# Altium schematic sheet 28Pins_Schematics.SchDoc
size A2
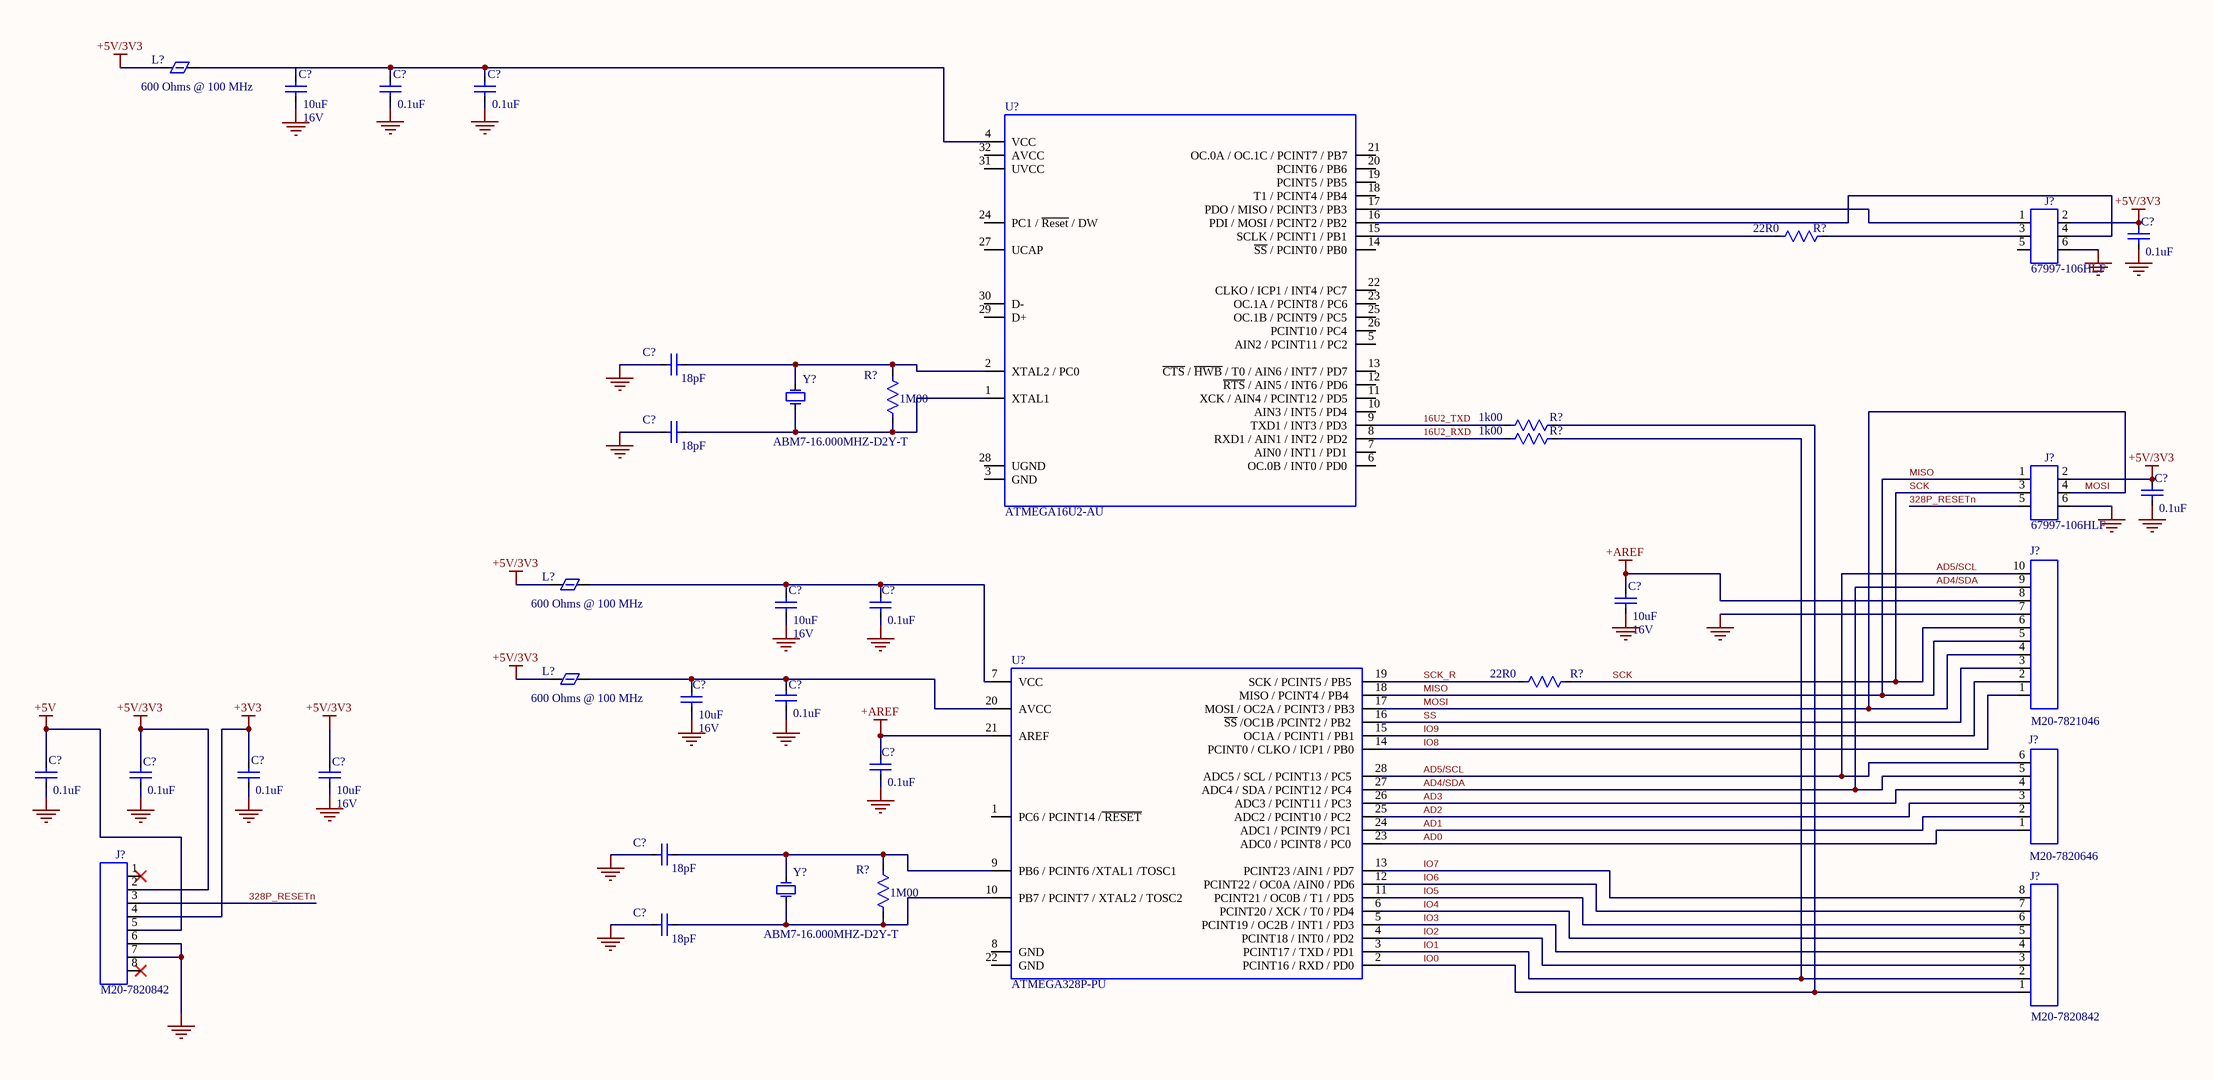
[diagram p0: 28Pins_Schematics.SchDoc]

## Parts
(Parts that share a designator on the sheet are numbered #1, #2 ... from top to bottom, then left to right.)
C?#1  value 10uF  Voltage: 16V  [CAPC2012X14N]  (hidden comment: C0805_10uF_10%_16V_X7R)
C?#2  value 0.1uF  [CAPC2012X14N]  (hidden comment: C0805_0.1uF_10%_50V_X7R)
C?#3  value 0.1uF  [CAPC2012X14N]  (hidden comment: C0805_0.1uF_10%_50V_X7R)
C?#4  value 0.1uF  [CAPC2012X14N]  (hidden comment: C0805_0.1uF_10%_50V_X7R)
C?#5  value 18pF  [CAPC1608X09N]  (hidden comment: C0603_18pF_±5%_100V_C0G)
C?#6  value 18pF  [CAPC1608X09N]  (hidden comment: C0603_18pF_±5%_100V_C0G)
C?#7  value 0.1uF  [CAPC2012X14N]  (hidden comment: C0805_0.1uF_10%_50V_X7R)
C?#8  value 10uF  Voltage: 16V  [CAPC2012X14N]  (hidden comment: C0805_10uF_10%_16V_X7R)
C?#9  value 10uF  Voltage: 16V  [CAPC2012X14N]  (hidden comment: C0805_10uF_10%_16V_X7R)
C?#10  value 0.1uF  [CAPC2012X14N]  (hidden comment: C0805_0.1uF_10%_50V_X7R)
C?#11  value 0.1uF  [CAPC2012X14N]  (hidden comment: C0805_0.1uF_10%_50V_X7R)
C?#12  value 10uF  Voltage: 16V  [CAPC2012X14N]  (hidden comment: C0805_10uF_10%_16V_X7R)
C?#13  value 0.1uF  [CAPC2012X14N]  (hidden comment: C0805_0.1uF_10%_50V_X7R)
C?#14  value 0.1uF  [CAPC2012X14N]  (hidden comment: C0805_0.1uF_10%_50V_X7R)
C?#15  value 0.1uF  [CAPC2012X14N]  (hidden comment: C0805_0.1uF_10%_50V_X7R)
C?#16  value 0.1uF  [CAPC2012X14N]  (hidden comment: C0805_0.1uF_10%_50V_X7R)
C?#17  value 10uF  Voltage: 16V  [CAPC2012X14N]  (hidden comment: C0805_10uF_10%_16V_X7R)
C?#18  value 18pF  [CAPC1608X09N]  (hidden comment: C0603_18pF_±5%_100V_C0G)
C?#19  value 18pF  [CAPC1608X09N]  (hidden comment: C0603_18pF_±5%_100V_C0G)
J?#1  67997-106HLF  [67997-106HLF-Footprint-1]
J?#2  67997-106HLF  [67997-106HLF-Footprint-1]
J?#3  M20-7821046  [M20-7821046-Footprint-1]
J?#4  M20-7820646  [M20-7820646-Footprint-1]
J?#5  M20-7820842  [M20-7820842-Footprint-1]
J?#6  M20-7820842  [M20-7820842-Footprint-1]
L?#1  value 600 Ohms @ 100 MHz  [INDC2012X14N]  (hidden comment: MPZ2012S601AT000)
L?#2  value 600 Ohms @ 100 MHz  [INDC2012X14N]  (hidden comment: MPZ2012S601AT000)
L?#3  value 600 Ohms @ 100 MHz  [INDC2012X14N]  (hidden comment: MPZ2012S601AT000)
R?#1  value 22R0  [RESC1005X03N]  (hidden comment: R0402_22R0_1%_1/16W)
R?#2  value 1M00  [RESC2012X06N]  (hidden comment: R0805_1M00_1%_1/8W)
R?#3  value 1k00  [RESC2012X06N]  (hidden comment: R0805_1k00_1%_1/8W)
R?#4  value 1k00  [RESC2012X06N]  (hidden comment: R0805_1k00_1%_1/8W)
R?#5  value 22R0  [RESC2012X06N]  (hidden comment: R0805_22R0_1%_1/8W)
R?#6  value 1M00  [RESC2012X06N]  (hidden comment: R0805_1M00_1%_1/8W)
U?#1  ATMEGA16U2-AU  [ATMEGA16U2-AU-Footprint-1]
U?#2  ATMEGA328P-PU  [ATMEGA328P-PU-Footprint-1]
Y?#1  ABM7-16.000MHZ-D2Y-T  [ABM7-16.000MHZ-D2Y-T-Footprint-1]
Y?#2  ABM7-16.000MHZ-D2Y-T  [ABM7-16.000MHZ-D2Y-T-Footprint-1]

## Nets
+3V3: C?#16.1 J?#5.4
+5V: C?#14.1 J?#5.5
+5V/3V3: C?#4.1 C?#7.1 C?#15.1 C?#17.1 J?#1.2 J?#2.2 J?#5.2 L?#1.1 L?#2.1 L?#3.1
+AREF: C?#8.1 C?#13.1 J?#3.8 U?#2.21(AREF)
GND: C?#1.2 C?#2.2 C?#3.2 C?#4.2 C?#5.1 C?#6.1 C?#7.2 C?#8.2 C?#9.2 C?#10.2 C?#11.2 C?#12.2 C?#13.2 C?#14.2 C?#15.2 C?#16.2 C?#17.2 C?#18.1 C?#19.1 J?#1.6 J?#2.6 J?#3.7 J?#5.6 J?#5.7
16U2_RXD: R?#4.2 U?#1.8(RXD1_/_AIN1_/_INT2_/_PD2)
16U2_TXD: R?#3.2 U?#1.9(TXD1_/_INT3_/_PD3)
328P_RESETn: J?#2.5 J?#5.3
AD0: J?#4.1 U?#2.23(ADC0_/_PCINT8_/_PC0)
AD1: J?#4.2 U?#2.24(ADC1_/_PCINT9_/_PC1)
AD2: J?#4.3 U?#2.25(ADC2_/_PCINT10_/_PC2)
AD3: J?#4.4 U?#2.26(ADC3_/_PCINT11_/_PC3)
AD4/SDA: J?#3.9 J?#4.5 U?#2.27(ADC4_/_SDA_/_PCINT12_/_PC4)
AD5/SCL: J?#3.10 J?#4.6 U?#2.28(ADC5_/_SCL_/_PCINT13_/_PC5)
IO0: J?#6.1 R?#3.1 U?#2.2(PCINT16_/_RXD_/_PD0)
IO1: J?#6.2 R?#4.1 U?#2.3(PCINT17_/_TXD_/_PD1)
IO2: J?#6.3 U?#2.4(PCINT18_/_INT0_/_PD2)
IO3: J?#6.4 U?#2.5(PCINT19_/_OC2B_/_INT1_/_PD3)
IO4: J?#6.5 U?#2.6(PCINT20_/_XCK_/_T0_/_PD4)
IO5: J?#6.6 U?#2.11(PCINT21_/_OC0B_/_T1_/_PD5)
IO6: J?#6.7 U?#2.12(PCINT22_/_OC0A_/AIN0_/_PD6)
IO7: J?#6.8 U?#2.13(PCINT23_/AIN1_/_PD7)
IO8: J?#3.1 U?#2.14(PCINT0_/_CLKO_/_ICP1_/_PB0)
IO9: J?#3.2 U?#2.15(OC1A_/_PCINT1_/_PB1)
MISO: J?#2.1 J?#3.5 U?#2.18(MISO_/_PCINT4_/_PB4)
MOSI: J?#2.4 J?#3.4 U?#2.17(MOSI_/_OC2A_/_PCINT3_/_PB3)
SCK: J?#2.3 J?#3.6 R?#5.2
SCK_R: R?#5.1 U?#2.19(SCK_/_PCINT5_/_PB5)
SS: J?#3.3 U?#2.16(~{SS}_/OC1B_/PCINT2_/_PB2)
NetC?#2_1: C?#2.1 C?#3.1 L?#1.2 U?#1.4(VCC)
NetC?#5_2: C?#5.2 R?#2.1 U?#1.2(XTAL2_/_PC0) Y?#1.1
NetC?#6_2: C?#6.2 R?#2.2 U?#1.1(XTAL1) Y?#1.2
NetC?#9_1: C?#9.1 C?#10.1 L?#2.2 U?#2.7(VCC)
NetC?#11_1: C?#11.1 C?#12.1 L?#3.2 U?#2.20(AVCC)
NetC?#18_2: C?#18.2 R?#6.1 U?#2.9(PB6_/_PCINT6_/XTAL1_/TOSC1) Y?#2.1
NetC?#19_2: C?#19.2 R?#6.2 U?#2.10(PB7_/_PCINT7_/_XTAL2_/_TOSC2) Y?#2.2
NetJ?#1_1: J?#1.1 U?#1.17(PDO_/_MISO_/_PCINT3_/_PB3)
NetJ?#1_3: J?#1.3 R?#1.1
NetJ?#1_4: J?#1.4 U?#1.16(PDI_/_MOSI_/_PCINT2_/_PB2)
NetR?#1_2: R?#1.2 U?#1.15(SCLK_/_PCINT1_/_PB1)

Not connected (* = marked no-connect by the designer): C?#1 1; J?#1 5; J?#5 1* 8*; U?#1 3(GND) 5(AIN2_/_PCINT11_/_PC2) 6(OC.0B_/_INT0_/_PD0) 7(AIN0_/_INT1_/_PD1) 10(AIN3_/_INT5_/_PD4) 11(XCK_/_AIN4_/_PCINT12_/_PD5) 12(~{RTS}_/_AIN5_/_INT6_/_PD6) 13(~{CTS}_/_~{HWB}_/_T0_/_AIN6_/_INT7_/_PD7) 14(~{SS}_/_PCINT0_/_PB0) 18(T1_/_PCINT4_/_PB4) 19(PCINT5_/_PB5) 20(PCINT6_/_PB6) 21(OC.0A_/_OC.1C_/_PCINT7_/_PB7) 22(CLKO_/_ICP1_/_INT4_/_PC7) 23(OC.1A_/_PCINT8_/_PC6) 24(PC1_/_~{Reset}_/_DW) 25(OC.1B_/_PCINT9_/_PC5) 26(PCINT10_/_PC4) 27(UCAP) 28(UGND) 29(D+) 30(D-) 31(UVCC) 32(AVCC); U?#2 1(PC6_/_PCINT14_/~{_RESET}) 8(GND) 22(GND)

## Library data of the parts
C?#1 C?#8 C?#9 C?#12 C?#17 = CMP-CAP-00156-1: Capacitor, X7R, 10uF, 10%, 16V, Surface Mount, 0805 (Metric: 2012), -55°C to 125°C; Manufacturer Name1: Samsung Electro-Mechanics; PN_MFG1: CL21B106KOQNNNE; PN_MFG2: CL21B106KOQNNNG; PN_MFG3: EMK212BB7106KG-T; Tolerance: 10%; Type: X7R; Temp: -55°C to 125°C; Manufacturer Name2: Samsung Electro-Mechanics; Size Code: 0805; Manufacturer Name3: Taiyo Yuden; Part Number: C0805_10uF_10%_16V_X7R
C?#2-C?#4 C?#7 C?#10 C?#11 C?#13-C?#16 = CMP-CAP-00145-1: Capacitor, X7R, 0.1uF, 10%, 50V, Surface Mount, 0805 (Metric: 2012), -55 to 125°C; Manufacturer Name1: Kemet; PN_MFG1: C0805C104K5RECAUTO; Tolerance: 10%; Size Code: 0805; Type: X7R; Part Number: C0805_0.1uF_10%_50V_X7R; Temp: -55 to 125°C
C?#5 C?#6 C?#18 C?#19 = CMP-CAP-00059-1: Capacitor, C0G, 18pF, ±5%, 100V, Surface Mount, 0603 (Metric: 1608), -55°C to 125°C; Manufacturer Name1: Vishay Vitramon; PN_MFG1: VJ0603A180JXBAC; PN_MFG3: 06031A180JAT2A; PN_MFG2: CC0603JRNPO0BN180; Tolerance: ±5%; Voltage: 100V; Size Code: 0603; Temp: -55°C to 125°C; Type: C0G; Manufacturer Name3: AVX Corporation; Manufacturer Name2: Yageo; Part Number: C0603_18pF_±5%_100V_C0G
J?#1 J?#2 = CMP-CON-00090-1: Connector Header Through Hole 6 position 0.100" (2.54mm); Current: 3A; Voltage: 100V; Value: 67997-106HLF
J?#3 = CMP-CON-00092-1: Connector Header Through Hole, 10 positions, 1 row, 0.100" pitch, 1000V, 3A, -40 to 105°C; Current: 3A; Value: M20-7821046; Voltage: 1000V
J?#4 = CMP-CON-00093-1: Connector Header Through Hole, Female, 6 positions, 1 row, 0.100" pitch, 1000V, 3A -40 to 105°C; Current: 3A; Value: M20-7820646; Voltage: 1000V
J?#5 J?#6 = CMP-CON-00091-2: Connector Header Through Hole, 8 positions, 1 row, 0.100'' pitch, 1000V, 3A, -40 to 105°C; Current: 3 A; Value: M20-7820842; Voltage: 1000V
L?#1-L?#3 = CMP-IND-00026-1: Ferrite bead, 600 Ohms @ 100 MHz, 2A, SMT, -55 to 125°C; Tolerance: 25%; Current: 2 A
R?#1 = CMP-RES-00271-1: Resistor, Thick film, 22R0, 1%, 1/16W, Surface Mount, 0402 (Metric: 1005), -55°C to 155°C; Manufacturer Name1: Vishay Dale; PN_MFG1: CRCW040222R0FKED; Temp: -55°C to 155°C; Part Number: R0402_22R0_1%_1/16W; Size Code: 0402
R?#2 R?#6 = CMP-RES-01476-1: Resistor, Thick film, 1M00, 1%, 1/8W, Surface Mount, 0805 (Metric: 2012), -55°C to 155°C; Manufacturer Name1: Vishay Dale; PN_MFG1: CRCW08051M00FKEA; PN_MFG2: CRCW08051M00FKEB; Size Code: 0805; Temp: -55°C to 155°C; Part Number: R0805_1M00_1%_1/8W; Manufacturer Name2: Vishay Dale
R?#3 R?#4 = CMP-RES-01475-1: Resistor, Thick film, 1k00, 1%, 1/8W, Surface Mount, 0805 (Metric: 2012), -55°C to 155°C; Manufacturer Name1: Vishay Dale; PN_MFG1: CRCW08051K00FKEA; PN_MFG2: CRCW08051K00FKEB; Part Number: R0805_1k00_1%_1/8W; Temp: -55°C to 155°C; Size Code: 0805; Manufacturer Name2: Vishay Dale
R?#5 = CMP-RES-01739-1: Resistor, Thick film, 22R0, 1%, 1/8W, Surface Mount, 0805 (Metric: 2012), -55°C to 155°C; Manufacturer Name1: Vishay Dale; PN_MFG2: CRCW080522R0FKEB; PN_MFG1: CRCW080522R0FKEA; Size Code: 0805; Part Number: R0805_22R0_1%_1/8W; Manufacturer Name2: Vishay Dale; Temp: -55°C to 155°C
U?#1 = CMP-IC-00117-2: RISC Microcontroller, 8-Bit, FLASH, AVR RISC CPU, 16MHz, CMOS, PQFP32; Value: ATMEGA16U2-AU
U?#2 = CMP-IC-00121-3: RISC Microcontroller, 8-Bit, FLASH, AVR RISC CPU, 20MHz, CMOS, PDIP28; Value: ATMEGA328P-PU
Y?#1 Y?#2 = CMP-OSC-00010-1: Crystal, 16.000MHz, 20 ppm, 18pF, Rs=50 Ohms, 2-SMD, -40 to 85°C; Tolerance: 20 ppm; Value: 16.000MHz